# Altium schematic sheet Connector.SchDoc: Connectors Sheet
size A3; Author: Kubilay Közleme; Organization: My Company; Address1: Address Line 1; Address2: Address Line 2; Address3: Address Line 3; Address4: Address Line 4; SheetNumber: 5; SheetTotal: 5; ProjectTitle: Drone Fligth Controller
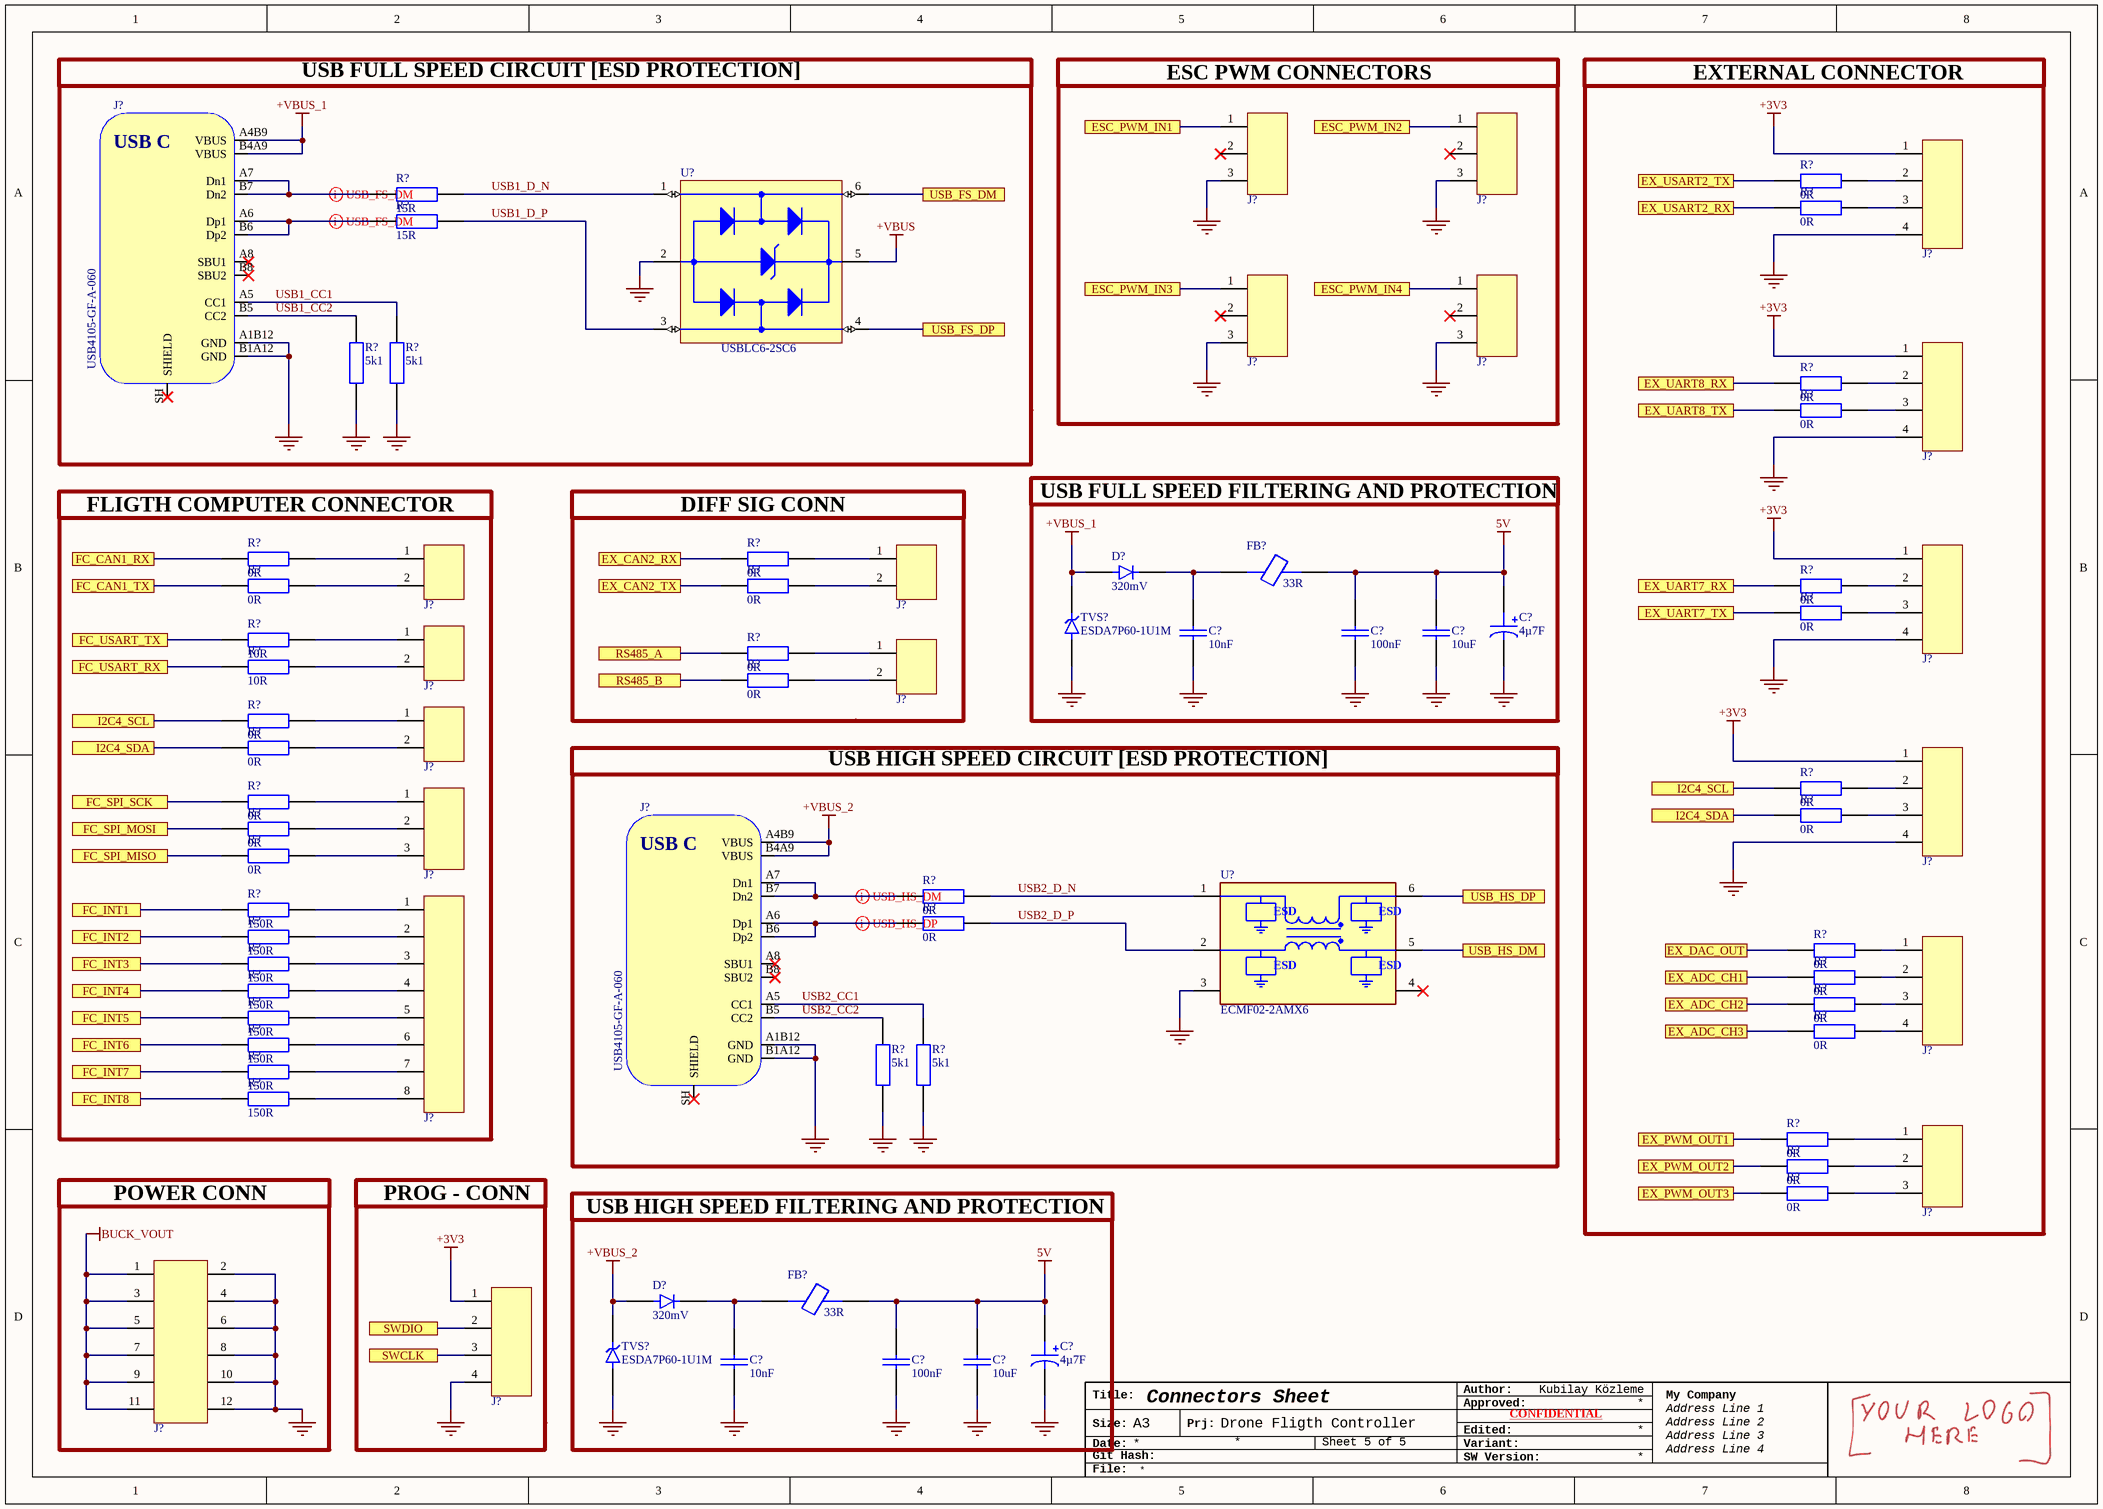
[diagram p0: Connector.SchDoc]

## Parts
(Parts that share a designator on the sheet are numbered #1, #2 ... from top to bottom, then left to right.)
C?#1  Capacitance Value: 4µ7F  [EDH475M025S9BAA]  (hidden comment: EDH475M025S9BAA)
C?#2  value 10nF  [CAP_0603]  (hidden comment: 0603B103K160CT)
C?#3  Capacitance: 100nF  [CAP_0603]  (hidden comment: C0603C104K1RACTU)
C?#4  value 10uF  [CAP_0603]  (hidden comment: ZRB18AR61C106ME01L)
C?#5  Capacitance Value: 4µ7F  [EDH475M025S9BAA]  (hidden comment: EDH475M025S9BAA)
C?#6  value 10nF  [CAP_0603]  (hidden comment: 0603B103K160CT)
C?#7  Capacitance: 100nF  [CAP_0603]  (hidden comment: C0603C104K1RACTU)
C?#8  value 10uF  [CAP_0603]  (hidden comment: ZRB18AR61C106ME01L)
D?#1  Forward Voltage-Max (VF): 320mV  [SOD-323]  (hidden comment: BAT60JFILM)
D?#2  Forward Voltage-Max (VF): 320mV  [SOD-323]  (hidden comment: BAT60JFILM)
FB?#1  Impedance: 33R  [BLM18PG330SN1D]  (hidden comment: BLM18PG330SN1D)
FB?#2  Impedance: 33R  [BLM18PG330SN1D]  (hidden comment: BLM18PG330SN1D)
J?#1  USB4105-GF-A-060  [USB4105-GF-A-060]
J?#2  0022272031  [0022272031]  (value not drawn)
J?#3  0022272031  [0022272031]  (value not drawn)
J?#4  S4B-PH-SM4-TB  [S4B-PH-SM4-TB]  (value not drawn)
J?#5  0022272031  [0022272031]  (value not drawn)
J?#6  0022272031  [0022272031]  (value not drawn)
J?#7  S4B-PH-SM4-TB  [S4B-PH-SM4-TB]  (value not drawn)
J?#8  S2B-PH-SM4-TB  [S2B-PH-SM4-TB]  (value not drawn)
J?#9  691502710002  [691502710002]  (value not drawn)
J?#10  S4B-PH-SM4-TB  [S4B-PH-SM4-TB]  (value not drawn)
J?#11  S2B-PH-SM4-TB  [S2B-PH-SM4-TB]  (value not drawn)
J?#12  691502710002  [691502710002]  (value not drawn)
J?#13  S2B-PH-SM4-TB  [S2B-PH-SM4-TB]  (value not drawn)
J?#14  S4B-PH-SM4-TB  [S4B-PH-SM4-TB]  (value not drawn)
J?#15  S3B-PH-SM4-TB  [S3B-PH-SM4-TB]  (value not drawn)
J?#16  USB4105-GF-A-060  [USB4105-GF-A-060]
J?#17  S8B-PH-SM4-TB  [S8B-PH-SM4-TB]  (value not drawn)
J?#18  S4B-PH-SM4-TB  [S4B-PH-SM4-TB]  (value not drawn)
J?#19  S3B-PH-SM4-TB  [S3B-PH-SM4-TB]  (value not drawn)
J?#20  G800W590018EU  [G800W590018EU]  (value not drawn)
J?#21  BCS-104-F-S-TE  [BCS-104-F-S-TE]  (value not drawn)
R?#1  Resistance: 0R  [RES_0603]  (hidden comment: RC0603JR-070RL)
R?#2  value 15R  [RES_0603]  (hidden comment: RC0603JR-0715RL)
R?#3  Resistance: 0R  [RES_0603]  (hidden comment: RC0603JR-070RL)
R?#4  value 15R  [RES_0603]  (hidden comment: RC0603JR-0715RL)
R?#5  Resistance: 0R  [RES_0603]  (hidden comment: RC0603JR-070RL)
R?#6  Resistance: 5k1  [RES_0603]  (hidden comment: RC0603FR-075K1L)
R?#7  Resistance: 5k1  [RES_0603]  (hidden comment: RC0603FR-075K1L)
R?#8  Resistance: 0R  [RES_0603]  (hidden comment: RC0603JR-070RL)
R?#9  Resistance: 0R  [RES_0603]  (hidden comment: RC0603JR-070RL)
R?#10  Resistance: 0R  [RES_0603]  (hidden comment: RC0603JR-070RL)
R?#11  Resistance: 0R  [RES_0603]  (hidden comment: RC0603JR-070RL)
R?#12  Resistance: 0R  [RES_0603]  (hidden comment: RC0603JR-070RL)
R?#13  Resistance: 0R  [RES_0603]  (hidden comment: RC0603JR-070RL)
R?#14  Resistance: 0R  [RES_0603]  (hidden comment: RC0603JR-070RL)
R?#15  Resistance: 10R  (hidden comment: ERJ-6ENF10R0V)
R?#16  Resistance: 0R  [RES_0603]  (hidden comment: RC0603JR-070RL)
R?#17  Resistance: 10R  (hidden comment: ERJ-6ENF10R0V)
R?#18  Resistance: 0R  [RES_0603]  (hidden comment: RC0603JR-070RL)
R?#19  Resistance: 0R  [RES_0603]  (hidden comment: RC0603JR-070RL)
R?#20  Resistance: 0R  [RES_0603]  (hidden comment: RC0603JR-070RL)
R?#21  Resistance: 0R  [RES_0603]  (hidden comment: RC0603JR-070RL)
R?#22  Resistance: 0R  [RES_0603]  (hidden comment: RC0603JR-070RL)
R?#23  Resistance: 0R  [RES_0603]  (hidden comment: RC0603JR-070RL)
R?#24  Resistance: 0R  [RES_0603]  (hidden comment: RC0603JR-070RL)
R?#25  Resistance: 0R  [RES_0603]  (hidden comment: RC0603JR-070RL)
R?#26  Resistance: 0R  [RES_0603]  (hidden comment: RC0603JR-070RL)
R?#27  Resistance: 150R  [RES_0603]  (hidden comment: RC0603FR-07150RL)
R?#28  Resistance: 0R  [RES_0603]  (hidden comment: RC0603JR-070RL)
R?#29  Resistance: 150R  [RES_0603]  (hidden comment: RC0603FR-07150RL)
R?#30  Resistance: 0R  [RES_0603]  (hidden comment: RC0603JR-070RL)
R?#31  Resistance: 150R  [RES_0603]  (hidden comment: RC0603FR-07150RL)
R?#32  Resistance: 0R  [RES_0603]  (hidden comment: RC0603JR-070RL)
R?#33  Resistance: 150R  [RES_0603]  (hidden comment: RC0603FR-07150RL)
R?#34  Resistance: 0R  [RES_0603]  (hidden comment: RC0603JR-070RL)
R?#35  Resistance: 150R  [RES_0603]  (hidden comment: RC0603FR-07150RL)
R?#36  Resistance: 0R  [RES_0603]  (hidden comment: RC0603JR-070RL)
R?#37  Resistance: 150R  [RES_0603]  (hidden comment: RC0603FR-07150RL)
R?#38  Resistance: 150R  [RES_0603]  (hidden comment: RC0603FR-07150RL)
R?#39  Resistance: 150R  [RES_0603]  (hidden comment: RC0603FR-07150RL)
R?#40  Resistance: 5k1  [RES_0603]  (hidden comment: RC0603FR-075K1L)
R?#41  Resistance: 5k1  [RES_0603]  (hidden comment: RC0603FR-075K1L)
R?#42  Resistance: 0R  [RES_0603]  (hidden comment: RC0603JR-070RL)
R?#43  Resistance: 0R  [RES_0603]  (hidden comment: RC0603JR-070RL)
R?#44  Resistance: 0R  [RES_0603]  (hidden comment: RC0603JR-070RL)
TVS?#1  ESDA7P60-1U1M  [ESDA7P60-1U1M]
TVS?#2  ESDA7P60-1U1M  [ESDA7P60-1U1M]
U?#1  USBLC6-2SC6  [SOT23-6L]
U?#2  ECMF02-2AMX6  [ECMF02-2AMX6]

## Blocks framed on the sheet
USB FULL SPEED CIRCUIT [ESD PROTECTION]: J?#1 R?#2 R?#4 R?#6 R?#7 U?#1
ESC PWM CONNECTORS: J?#2 J?#3 J?#5 J?#6
EXTERNAL CONNECTOR: J?#4 J?#7 J?#10 J?#14 J?#18 J?#19 R?#1 R?#3 R?#5 R?#8 R?#13 R?#14 R?#21 R?#23 R?#30 R?#32 R?#34 R?#36 R?#42-R?#44
FLIGTH COMPUTER CONNECTOR: J?#8 J?#11 J?#13 J?#15 J?#17 R?#9 R?#11 R?#15 R?#17 R?#19 R?#20 R?#22 R?#24 R?#25 R?#27 R?#29 R?#31 R?#33 R?#35 R?#37-R?#39
DIFF SIG CONN: J?#9 J?#12 R?#10 R?#12 R?#16 R?#18
USB FULL SPEED FILTERING AND PROTECTION: C?#1-C?#4 D?#1 FB?#1 TVS?#1
USB HIGH SPEED CIRCUIT [ESD PROTECTION]: J?#16 R?#26 R?#28 R?#40 R?#41 U?#2
POWER CONN: J?#20
PROG - CONN: J?#21
USB HIGH SPEED FILTERING AND PROTECTION: C?#5-C?#8 D?#2 FB?#2 TVS?#2

## Ports
ESC_PWM_IN1 (see Microcontroller[3C]), ESC_PWM_IN2 (see Microcontroller[3C]), ESC_PWM_IN3 (see Microcontroller[3C]), ESC_PWM_IN4 (see Microcontroller[3C]), EX_ADC_CH1 (see Microcontroller[3C]), EX_ADC_CH2 (see Microcontroller[3C]), EX_ADC_CH3 (see Microcontroller[3C]), EX_CAN2_RX (see Microcontroller[3B]), EX_CAN2_TX (see Microcontroller[3C]), EX_DAC_OUT (see Microcontroller[3C]), EX_PWM_OUT1 (see Microcontroller[1C]), EX_PWM_OUT2 (see Microcontroller[1C]), EX_PWM_OUT3 (see Microcontroller[1C]), EX_UART7_RX (see Microcontroller[3C]), EX_UART7_TX (see Microcontroller[3C]), EX_UART8_RX (see Microcontroller[3C]), EX_UART8_TX (see Microcontroller[3C]), EX_USART2_RX (see Microcontroller[3C]), EX_USART2_TX (see Microcontroller[3C]), FC_CAN1_RX (see Microcontroller[3C]), FC_CAN1_TX (see Microcontroller[3C]), FC_INT1 (see Microcontroller[1C]), FC_INT2 (see Microcontroller[1C]), FC_INT3 (see Microcontroller[1C]), FC_INT4 (see Microcontroller[1C]), FC_INT5 (see Microcontroller[1C]), FC_INT6 (see Microcontroller[1C]), FC_INT7 (see Microcontroller[1C]), FC_INT8 (see Microcontroller[1C]), FC_SPI_MISO (see Microcontroller[3B]), FC_SPI_MOSI (see Microcontroller[3B]), FC_SPI_SCK (see Microcontroller[3B]), FC_USART_RX (see Microcontroller[3B]), FC_USART_TX (see Microcontroller[3B]), I2C4_SCL (see Connector[1B], Microcontroller[1B], Microcontroller[8B]), I2C4_SCL (see Connector[7C], Microcontroller[1B], Microcontroller[8B]), I2C4_SDA (see Connector[1B], Microcontroller[1B], Microcontroller[8B]), I2C4_SDA (see Connector[7C], Microcontroller[1B], Microcontroller[8B]), RS485_A, RS485_B, SWCLK (see Microcontroller[3B]), SWDIO (see Microcontroller[3A]), USB_FS_DM (see Microcontroller[1C]), USB_FS_DP (see Microcontroller[1C]), USB_HS_DM (see Microcontroller[1C]), USB_HS_DP (see Microcontroller[1C])

## Nets
5V: C?#1.1 C?#3.2 C?#4.2 C?#5.1 C?#7.2 C?#8.2 FB?#1.2 FB?#2.2
+3V3: J?#4.1 J?#7.1 J?#10.1 J?#14.1 J?#21.1
+VBUS: U?#1.5(VBUS)
+VBUS_1: D?#1.A J?#1.A4B9(VBUS) J?#1.B4A9(VBUS) TVS?#1.C
+VBUS_2: D?#2.A J?#16.A4B9(VBUS) J?#16.B4A9(VBUS) TVS?#2.C
BUCK_VOUT: J?#20.1 J?#20.3 J?#20.5 J?#20.7 J?#20.9 J?#20.11
GND: C?#1.2 C?#2.1 C?#3.1 C?#4.1 C?#5.2 C?#6.1 C?#7.1 C?#8.1 J?#1.A1B12(GND) J?#1.B1A12(GND) J?#2.3 J?#3.3 J?#4.4 J?#5.3 J?#6.3 J?#7.4 J?#10.4 J?#14.4 J?#16.A1B12(GND) J?#16.B1A12(GND) J?#20.2 J?#20.4 J?#20.6 J?#20.8 J?#20.10 J?#20.12 J?#21.4 R?#6.1 R?#7.1 R?#40.1 R?#41.1 TVS?#1.A TVS?#2.A U?#1.2(GND) U?#2.3(GND)
ESC_PWM_IN1: J?#2.1 ; port ESC_PWM_IN1
ESC_PWM_IN2: J?#3.1 ; port ESC_PWM_IN2
ESC_PWM_IN3: J?#5.1 ; port ESC_PWM_IN3
ESC_PWM_IN4: J?#6.1 ; port ESC_PWM_IN4
EX_ADC_CH1: R?#32.1 ; port EX_ADC_CH1
EX_ADC_CH2: R?#34.1 ; port EX_ADC_CH2
EX_ADC_CH3: R?#36.1 ; port EX_ADC_CH3
EX_CAN2_RX: R?#10.1 ; port EX_CAN2_RX
EX_CAN2_TX: R?#12.1 ; port EX_CAN2_TX
EX_DAC_OUT: R?#30.1 ; port EX_DAC_OUT
EX_PWM_OUT1: R?#42.1 ; port EX_PWM_OUT1
EX_PWM_OUT2: R?#43.1 ; port EX_PWM_OUT2
EX_PWM_OUT3: R?#44.1 ; port EX_PWM_OUT3
EX_UART7_RX: R?#13.1 ; port EX_UART7_RX
EX_UART7_TX: R?#14.1 ; port EX_UART7_TX
EX_UART8_RX: R?#5.1 ; port EX_UART8_RX
EX_UART8_TX: R?#8.1 ; port EX_UART8_TX
EX_USART2_RX: R?#3.1 ; port EX_USART2_RX
EX_USART2_TX: R?#1.1 ; port EX_USART2_TX
FC_CAN1_RX: R?#9.1 ; port FC_CAN1_RX
FC_CAN1_TX: R?#11.1 ; port FC_CAN1_TX
FC_INT1: R?#27.1 ; port FC_INT1
FC_INT2: R?#29.1 ; port FC_INT2
FC_INT3: R?#31.1 ; port FC_INT3
FC_INT4: R?#33.1 ; port FC_INT4
FC_INT5: R?#35.1 ; port FC_INT5
FC_INT6: R?#37.1 ; port FC_INT6
FC_INT7: R?#38.1 ; port FC_INT7
FC_INT8: R?#39.1 ; port FC_INT8
FC_SPI_MISO: R?#25.1 ; port FC_SPI_MISO
FC_SPI_MOSI: R?#24.1 ; port FC_SPI_MOSI
FC_SPI_SCK: R?#22.1 ; port FC_SPI_SCK
FC_USART_RX: R?#17.1 ; port FC_USART_RX
FC_USART_TX: R?#15.1 ; port FC_USART_TX
I2C4_SCL: R?#19.1 R?#21.1 ; port I2C4_SCL
I2C4_SDA: R?#20.1 R?#23.1 ; port I2C4_SDA
RS485_A: R?#16.1 ; port RS485_A
RS485_B: R?#18.1 ; port RS485_B
SWCLK: J?#21.3 ; port SWCLK
SWDIO: J?#21.2 ; port SWDIO
USB1_CC1: J?#1.A5(CC1) R?#7.2
USB1_CC2: J?#1.B5(CC2) R?#6.2
USB1_D_N: R?#2.2 U?#1.1(I/O1_IN)
USB1_D_P: R?#4.2 U?#1.3(I/O2_IN)
USB2_CC1: J?#16.A5(CC1) R?#41.2
USB2_CC2: J?#16.B5(CC2) R?#40.2
USB2_D_N: R?#26.2 U?#2.1(D+_IN)
USB2_D_P: R?#28.2 U?#2.2(D-_IN)
USB_FS_DM: U?#1.6(I/O1_OUT) ; port USB_FS_DM
USB_FS_DP: U?#1.4(I/O2_OUT) ; port USB_FS_DP
USB_HS_DM: U?#2.5(D-_OUT) ; port USB_HS_DM
USB_HS_DP: U?#2.6(D+_OUT) ; port USB_HS_DP
NetC?#2_2: C?#2.2 D?#1.C FB?#1.1
NetC?#6_2: C?#6.2 D?#2.C FB?#2.1
NetJ?#1_A6: J?#1.A6(Dp1) J?#1.B6(Dp2) R?#4.1
NetJ?#1_A7: J?#1.A7(Dn1) J?#1.B7(Dn2) R?#2.1
NetJ?#4_2: J?#4.2 R?#1.2
NetJ?#4_3: J?#4.3 R?#3.2
NetJ?#7_2: J?#7.2 R?#5.2
NetJ?#7_3: J?#7.3 R?#8.2
NetJ?#8_1: J?#8.1 R?#9.2
NetJ?#8_2: J?#8.2 R?#11.2
NetJ?#9_1: J?#9.1 R?#10.2
NetJ?#9_2: J?#9.2 R?#12.2
NetJ?#10_2: J?#10.2 R?#13.2
NetJ?#10_3: J?#10.3 R?#14.2
NetJ?#11_1: J?#11.1 R?#15.2
NetJ?#11_2: J?#11.2 R?#17.2
NetJ?#12_1: J?#12.1 R?#16.2
NetJ?#12_2: J?#12.2 R?#18.2
NetJ?#13_1: J?#13.1 R?#19.2
NetJ?#13_2: J?#13.2 R?#20.2
NetJ?#14_2: J?#14.2 R?#21.2
NetJ?#14_3: J?#14.3 R?#23.2
NetJ?#15_1: J?#15.1 R?#22.2
NetJ?#15_2: J?#15.2 R?#24.2
NetJ?#15_3: J?#15.3 R?#25.2
NetJ?#16_A6: J?#16.A6(Dp1) J?#16.B6(Dp2) R?#28.1
NetJ?#16_A7: J?#16.A7(Dn1) J?#16.B7(Dn2) R?#26.1
NetJ?#17_1: J?#17.1 R?#27.2
NetJ?#17_2: J?#17.2 R?#29.2
NetJ?#17_3: J?#17.3 R?#31.2
NetJ?#17_4: J?#17.4 R?#33.2
NetJ?#17_5: J?#17.5 R?#35.2
NetJ?#17_6: J?#17.6 R?#37.2
NetJ?#17_7: J?#17.7 R?#38.2
NetJ?#17_8: J?#17.8 R?#39.2
NetJ?#18_1: J?#18.1 R?#30.2
NetJ?#18_2: J?#18.2 R?#32.2
NetJ?#18_3: J?#18.3 R?#34.2
NetJ?#18_4: J?#18.4 R?#36.2
NetJ?#19_1: J?#19.1 R?#42.2
NetJ?#19_2: J?#19.2 R?#43.2
NetJ?#19_3: J?#19.3 R?#44.2

Not connected (* = marked no-connect by the designer): J?#1 A8(SBU1)* B8(SBU2)* SH(SHIELD)*; J?#2 2*; J?#3 2*; J?#5 2*; J?#6 2*; J?#16 A8(SBU1)* B8(SBU2)* SH(SHIELD)*; U?#2 4(NC)*

## Layout directives
differential pair; differential pair class USB_FS: NetJ?#1_A6, NetJ?#1_A7
differential pair; differential pair class USB_HS: NetJ?#16_A6, NetJ?#16_A7

## Notes on the sheet
- Pin current rated 3A
  Max out current 6A
- Title:
- Author:
- Approved:
- Size:
- Date:
- Git Hash:
- A3
- Prj:
- SW Version:
- Variant:
- Edited:
- CONFIDENTIAL
- File:
- (in symbol ECMF02-2AMX6) ESD
- (in symbol USB4105-GF-A-060) USB C

## Library data of the parts
C?#1 C?#5 = EDH475M025S9BAA: EDH ALUMINUM ELECTROLYTIC CAPACITOR Radial Can - SMD aluminum electrolytic capacitor 0.157Dia 4.00mm ±20% 4.7muF 25V; Manufacturer: KEMET; Designed By: Kubilay Közleme; Supplier 1: Digikey; Manufacturer Part Number: EDH475M025S9BAA; Category: Aluminum Electrolytic Capacitors; Stock 1: 40000; Pricing 1: 1=0.31, 10=0.183, 50=0.131, 100=0.1149, 500=0.08754, 1000=0.07901 (USD); ComponentLink1URL: https://api.kemet.com/component-edge/download/datasheet/EDH475M025S9BAA.pdf?src-supplier=Digikey; ComponentLink1Description: https://api.kemet.com/component-edge/download/datasheet/EDH475M025S9BAA.pdf?src-supplier=Digikey; Supplier Part Number 1: 399-EDH475M025S9BAACT-ND
C?#2 C?#6 = CAP CER 10nF 0603: 0603 16V X7R .01uF 10% multilayer ceramic capacitor; Manufacturer: Walsin Technologies; Designed By: Kubilay Közleme; Supplier 1: Digikey; Manufacturer Part Number: 0603B103K160CT; RoHS: Yes; Category: Ceramic Capacitors; Stock 1: 65786; Pricing 1: 1=0.1, 10=0.031, 50=0.018, 100=0.0139, 500=0.0105, 1000=0.00825 (USD); Lead Free: 5697LeadFree; ComponentLink1URL: http://www.farnell.com/datasheets/1958513.pdf?src-supplier=Farnell; ComponentLink1Description: http://www.farnell.com/datasheets/1958513.pdf?src-supplier=Farnell; ComponentLink2URL: https://datasheet.octopart.com/0603B103K160CT-Walsin-Technologies-datasheet-136037192.pdf?src-supplier=Future+Electronics; ComponentLink2Description: https://datasheet.octopart.com/0603B103K160CT-Walsin-Technologies-datasheet-136037192.pdf?src-supplier=Future+Electronics; ComponentLink3URL: http://www.passivecomponent.com/wp-content/uploads/2018/10/MLCC.pdf?src-supplier=Digikey; ComponentLink3Description: http://www.passivecomponent.com/wp-content/uploads/2018/10/MLCC.pdf?src-supplier=Digikey; ComponentLink4URL: https://datasheet.octopart.com/0603B103K160CT-Walsin-Technologies-datasheet-85392065.pdf?src-supplier=Element14; ComponentLink4Description: https://datasheet.octopart.com/0603B103K160CT-Walsin-Technologies-datasheet-85392065.pdf?src-supplier=Element14; ComponentLink5URL: https://datasheet.octopart.com/0603B103K160CT-Walsin-Technologies-datasheet-62066062.pdf?src-supplier=TME; ComponentLink5Description: https://datasheet.octopart.com/0603B103K160CT-Walsin-Technologies-datasheet-62066062.pdf?src-supplier=TME; Supplier Part Number 1: 1292-1384-1-ND
C?#3 C?#7 = CAP CER 100nF 0603: Cap Cer 0603 0.1UF 100VDC X7R; Manufacturer: KEMET; Dielectric: 1511DielectricType; Voltage Rating (DC): 100V; Designed By: Kubilay Közleme; Supplier 1: Digikey; Manufacturer Part Number: C0603C104K1RACTU; RoHS: No; Category: Ceramic Capacitors; Stock 1: 10169; Pricing 1: 1=0.28, 10=0.185, 50=0.1296, 100=0.1047, 500=0.07782, 1000=0.06808 (USD); Case/Package: 345Case; Supplier Part Number 1: 399-C0603C104K1RACTUCT-ND
C?#4 C?#8 = CAP CER 10uF 0603: Ceramic Capacitor, Multilayer, Ceramic, 16V, 20% +Tol, 20% -Tol, X5R, 15% TC, 10uF, Surface Mount, 0603; Manufacturer: Murata; Designed By: Kubilay Közleme; Supplier 1: Digikey; RoHS: Yes; Category: Ceramic Capacitors; Stock 1: 123060; Pricing 1: 1=0.48, 10=0.284, 50=0.2068, 100=0.1828, 500=0.14188, 1000=0.1291 (USD); Number of Pins: 2; Dielectric Material: Ceramic; Capacitor Type: Ceramic; Reach SVHC Compliant: Yes; RoHS Compliant: Yes; ComponentLink1URL: https://datasheet.ciiva.com:443/pdfs/VipMasterIC/IC/MURE/MURE-S-A0004380799/MURE-S-A0004414209-1.pdf?src-supplier=IHS+Markit; ComponentLink1Description: https://datasheet.ciiva.com:443/pdfs/VipMasterIC/IC/MURE/MURE-S-A0004380799/MURE-S-A0004414209-1.pdf?src-supplier=IHS+Markit; ComponentLink2URL: http://www.farnell.com/datasheets/2163235.pdf?src-supplier=Farnell; ComponentLink2Description: http://www.farnell.com/datasheets/2163235.pdf?src-supplier=Farnell; ComponentLink3URL: http://search.murata.co.jp/Ceramy/image/img/A01X/G101/ENG/ZRB18AR61C106ME01-01.pdf?src-supplier=Digikey; ComponentLink3Description: http://search.murata.co.jp/Ceramy/image/img/A01X/G101/ENG/ZRB18AR61C106ME01-01.pdf?src-supplier=Digikey; ComponentLink4URL: http://www.farnell.com/datasheets/2163235.pdf?src-supplier=Newark; ComponentLink4Description: http://www.farnell.com/datasheets/2163235.pdf?src-supplier=Newark; ComponentLink5URL: http://www.farnell.com/datasheets/2163235.pdf?src-supplier=Element14; ComponentLink5Description: http://www.farnell.com/datasheets/2163235.pdf?src-supplier=Element14; ComponentLink6URL: https://datasheet.octopart.com/ZRB18AR61C106ME01L-Murata-datasheet-62317488.pdf?src-supplier=Element14; ComponentLink6Description: https://datasheet.octopart.com/ZRB18AR61C106ME01L-Murata-datasheet-62317488.pdf?src-supplier=Element14; ComponentLink7URL: https://datasheet.octopart.com/ZRB18AR61C106ME01L-Murata-datasheet-67356777.pdf?src-supplier=Newark; ComponentLink7Description: https://datasheet.octopart.com/ZRB18AR61C106ME01L-Murata-datasheet-67356777.pdf?src-supplier=Newark; ComponentLink8URL: https://datasheet.octopart.com/ZRB18AR61C106ME01L-Murata-datasheet-86813782.pdf?src-supplier=Future+Electronics; ComponentLink8Description: https://datasheet.octopart.com/ZRB18AR61C106ME01L-Murata-datasheet-86813782.pdf?src-supplier=Future+Electronics; ComponentLink9URL: https://datasheet.octopart.com/ZRB18AR61C106ME01L-Murata-datasheet-166166242.pdf?src-supplier=TME; ComponentLink9Description: https://datasheet.octopart.com/ZRB18AR61C106ME01L-Murata-datasheet-166166242.pdf?src-supplier=TME; Supplier Part Number 1: 490-10990-6-ND; Manufacturer Part Number: ZRB18AR61C106ME01L
D?#1 D?#2 = BAT60JFILM: Rectifier Diode, Schottky, 1 Phase, 1 Element, 3A, 10V V(RRM), Silicon; Manufacturer: STMicroelectronics; Package Body Material: Plastic; Application(s): GENERAL PURPOSE; Non-rep Pk Forward Current-Max: 5A; Number of Elements: 1; Max Power Dissipation: 310mW; Time @ Peak Reflow Temperature-Max (s): 30s; Qualification Status: Not Qualified; Designed By: Kubilay Közleme; Supplier 1: Digikey; Manufacturer Part Number: BAT60JFILM; RoHS: Yes; Category: Rectifier Diodes; Stock 1: 166671; Pricing 1: 1=0.22, 10=0.15, 100=0.1007, 500=0.07718, 1000=0.06926 (USD); Number of Pins: 2; Diode Element Material: SILICON; Package Shape: Rectangular; Terminal Finish: Tin; Max Operating Temperature: 150°C; JESD-609 Code: e3; Diode Type: RECTIFIER; JESD-30 Code: R-PDSO-G2; Moisture Sensitivity Level: 1; Number of Phases: 1; Max Output Current: 3A; Package Style: SMALL OUTLINEMeter; Peak Reflow Temperature (Cel): 260°C; Rep Pk Reverse Voltage-Max: 10V; Surface Mount: Yes; Technology: SCHOTTKY; Terminal Form: Gull Wing; Terminal Position: DUAL; Reach SVHC Compliant: Yes; RoHS Compliant: Yes; ComponentLink1URL: https://datasheet.ciiva.com:443/pdfs/VipMasterIC/IC/SGST/SGSTS19081/SGSTS19081-1.pdf?src-supplier=IHS+Markit; ComponentLink1Description: https://datasheet.ciiva.com:443/pdfs/VipMasterIC/IC/SGST/SGSTS19081/SGSTS19081-1.pdf?src-supplier=IHS+Markit; ComponentLink2URL: https://datasheet.ciiva.com/1200/1689728-1200741.pdf?src-supplier=Farnell; ComponentLink2Description: https://datasheet.ciiva.com/1200/1689728-1200741.pdf?src-supplier=Farnell; ComponentLink3URL: https://datasheet.ciiva.com/4714/cd00001944-96586-4714681.pdf?src-supplier=Mouser; ComponentLink3Description: https://datasheet.ciiva.com/4714/cd00001944-96586-4714681.pdf?src-supplier=Mouser; ComponentLink4URL: https://datasheet.ciiva.com/23916/cd00001944-23916545.pdf?src-supplier=Newark; ComponentLink4Description: https://datasheet.ciiva.com/23916/cd00001944-23916545.pdf?src-supplier=Newark; ComponentLink5URL: https://datasheet.ciiva.com/17078/bat60jfilm-17078717.pdf?src-supplier=Allied+Electronics; ComponentLink5Description: https://datasheet.ciiva.com/17078/bat60jfilm-17078717.pdf?src-supplier=Allied+Electronics; ComponentLink6URL: https://datasheet.ciiva.com/915/cd00001944-915607.pdf?src-supplier=Digikey; ComponentLink6Description: https://datasheet.ciiva.com/915/cd00001944-915607.pdf?src-supplier=Digikey; ComponentLink7URL: https://datasheet.ciiva.com/915/cd00001944-915608.pdf?src-supplier=Digikey; ComponentLink7Description: https://datasheet.ciiva.com/915/cd00001944-915608.pdf?src-supplier=Digikey; ComponentLink8URL: https://datasheet.ciiva.com/915/cd00001944-915609.pdf?src-supplier=Digikey; ComponentLink8Description: https://datasheet.ciiva.com/915/cd00001944-915609.pdf?src-supplier=Digikey; ComponentLink9URL: https://datasheet.ciiva.com/15144/getdatasheetpartid-91415-15144683.pdf?src-supplier=Verical; ComponentLink9Description: https://datasheet.ciiva.com/15144/getdatasheetpartid-91415-15144683.pdf?src-supplier=Verical; Supplier Part Number 1: 497-3707-1-ND
FB?#1 FB?#2 = BLM18PG330SN1D: Ferrite Beads Multi-Layer 33 Ohm 25% 100MHz 3A 25m Ohm DCR 0603 Paper; Manufacturer: Murata; Manufacturer Series: BLM18P; Material: Steel,Ferrite; Resistance: 25mR; Number of Lines: 1; Shielding: Unshielded; Designed By: Kubilay Közleme; Supplier 1: Digikey; Manufacturer Part Number: BLM18PG330SN1D; RoHS: Yes; Category: Ferrite Beads and Chips; Stock 1: 80000; Pricing 1: 4000=0.0223, 8000=0.01943, 12000=0.01785, 20000=0.01725 (USD); Case/Package: 0603; Number of Pins: 2; Core Material: Ferrite; Case Code (Metric): 1608; Case Code (Imperial): 0603; Terminal Finish: Tin; Min Operating Temperature: -55°C; Max Operating Temperature: 125°C; Package Quantity: 1; Tolerance: 25%; Packaging: Tape and Reel; Current Rating: 3A; ESR (Equivalent Series Resistance): 33R; Max Current Rating: 3A; DC Resistance (DCR): 25mR; Max DC Current: 3A; Termination: SMD/SMT; Test Frequency: 100MHz; DC Current: 3A; Number of Circuits: 1; Series: BLM18P; DC Resistance-Max: 25mR; Number of Functions: 1; RMS Current (Irms): 3A; Series Resistance: 25mR; Length: 1.6mm; Width: 0.8mm; Height: 0.8mm; Depth: 0.8mm; Radiation Hardening: No; Reach SVHC Compliant: No; Lead Free: Lead Free; RoHS Compliant: Yes; ComponentLink1URL: https://datasheet.ciiva.com/8021/5148-8021488.pdf?src-supplier=Element14; ComponentLink1Description: https://datasheet.ciiva.com/8021/5148-8021488.pdf?src-supplier=Element14; ComponentLink2URL: https://datasheet.ciiva.com/19458/1845056-19458409.pdf?src-supplier=Jameco; ComponentLink2Description: https://datasheet.ciiva.com/19458/1845056-19458409.pdf?src-supplier=Jameco; ComponentLink3URL: https://datasheet.ciiva.com/1012/l0110s0100blm18p-1012160.pdf?src-supplier=Digikey; ComponentLink3Description: https://datasheet.ciiva.com/1012/l0110s0100blm18p-1012160.pdf?src-supplier=Digikey; ComponentLink4URL: https://datasheet.ciiva.com/11799/0900766b81275ca5-11799524.pdf?src-supplier=Rs; ComponentLink4Description: https://datasheet.ciiva.com/11799/0900766b81275ca5-11799524.pdf?src-supplier=Rs; ComponentLink5URL: https://datasheet.ciiva.com/1012/l0110s0100blm18p-1012159.pdf?src-supplier=Digikey; ComponentLink5Description: https://datasheet.ciiva.com/1012/l0110s0100blm18p-1012159.pdf?src-supplier=Digikey; ComponentLink6URL: https://datasheet.ciiva.com/1012/l0110s0100blm18p-1012158.pdf?src-supplier=Digikey; ComponentLink6Description: https://datasheet.ciiva.com/1012/l0110s0100blm18p-1012158.pdf?src-supplier=Digikey; ComponentLink7URL: https://datasheet.ciiva.com/16420/l0110s0100blm18p-16420745.pdf?src-supplier=Future+Electronics; ComponentLink7Description: https://datasheet.ciiva.com/16420/l0110s0100blm18p-16420745.pdf?src-supplier=Future+Electronics; Supplier Part Number 1: 490-5220-2-ND
J?#1 J?#16 = USB4105-GF-A-060: USB Connector, 24 Contact(s), Female, Right Angle, Solder Terminal, Locking, Receptacle; Manufacturer: Global Connector Technology; Designed By: Kubilay Közleme; Supplier 1: Digikey; Manufacturer Part Number: USB4105-GF-A-060; RoHS: Yes; Category: Connectors; Stock 1: 2521; Pricing 1: 1=1.04, 10=0.789, 25=0.7096, 50=0.6552, 100=0.6057, 250=0.54704 (USD); ComponentLink1URL: https://datasheet.octopart.com/USB4105-GF-A-060-GCT-datasheet-166929323.pdf?src-supplier=TME; ComponentLink1Description: https://datasheet.octopart.com/USB4105-GF-A-060-GCT-datasheet-166929323.pdf?src-supplier=TME; Supplier Part Number 1: 2073-USB4105-GF-A-060DKR-ND
J?#2 J?#3 J?#5 J?#6 = 0022272031: Board Connector, 3 Contact(s), 1 Row(s), Male, Straight, 0.1 inch Pitch, Solder Terminal, Locking, White Insulator, Receptacle; Manufacturer: Molex; Option: General Purpose; Filter Feature: No; Mating Information: MULTIPLE MATING PARTS AVAILABLE; Number of Rows Loaded: 1; Number of Contacts: 3; Contact Pattern: RECTANGULAR; Contact Resistance: 10mR; Contact Style: SQ PIN-SKT; Durability: 25Cycles; Insulation Resistance: 1GR; Polarization Key: POLARIZED HOUSING; Rated Current (Signal): 4A; Body Breadth: 0.23inch; Body Depth: 0.46inch; Body Length: 0.3inch; Plating Thickness: 100uin; Reference Standard: UL; Reliability: COMMERCIAL; Designed By: Kubilay Közleme; Supplier 1: Digikey; Manufacturer Part Number: 22-27-2031; RoHS: Yes; Category: Headers and Wire Housings; Stock 1: 123474; Pricing 1: 1=0.46, 10=0.34, 100=0.2589, 500=0.21876, 2000=0.19237, 6000=0.1757, 10000=0.16902 (USD); Mount: Board; Contact Finish - Mating: TIN; Contact Finish - Termination: Tin (Sn); Contact Material: Brass; Insulation Color: White; Insulation Material: Nylon; Min Operating Temperature: 0°C; Max Operating Temperature: 75°C; Connector Type: BOARD CONNECTOR; JESD-609 Code: e3; Contact Gender: Male; Mixed Contacts: No; Mounting Style: STRAIGHT; Termination: Solder; Body/Shell Style: RECEPTACLE; Number Of Connectors: 1; Number Of PCB Rows: 1; PCB Contact Pattern: RECTANGULAR; Terminal Pitch: 2.54mm; Mating Contact Pitch: 0.1inch; Mounting Option 1: LOCKING; Terminal Length: 0.14inch; Flammability Rating: UL94 V-0; Reach SVHC Compliant: Yes; RoHS Compliant: Yes; DIN Conformance: No; IEC Conformance: No; MIL Conformance: No; ComponentLink1URL: https://datasheet.ciiva.com:443/pdfs/VipMasterIC/IC/MOLE/MOLE-E-A0003552261/MOLE-S-A0003534498-1.pdf?src-supplier=IHS+Markit; ComponentLink1Description: https://datasheet.ciiva.com:443/pdfs/VipMasterIC/IC/MOLE/MOLE-E-A0003552261/MOLE-S-A0003534498-1.pdf?src-supplier=IHS+Markit; Supplier Part Number 1: WM4112-ND
J?#4 J?#7 J?#10 J?#14 J?#18 = S4B-PH-SM4-TB: Header S4B-PH-SM4-TB, 2.00mm, 4-contacts, side entry, SMT, /1000/reel; Manufacturer: JST; Designed By: Kubilay Közleme; Supplier 1: Digikey; Manufacturer Part Number: S4B-PH-SM4-TB; RoHS: No; Category: Connectors; Stock 1: 6528; Pricing 1: 1=0.78, 10=0.682, 100=0.5621, 500=0.48874 (USD); ComponentLink1URL: https://datasheet.ciiva.com/26894/getdatasheetpartid-560757-26894923.pdf?src-supplier=Verical; ComponentLink1Description: https://datasheet.ciiva.com/26894/getdatasheetpartid-560757-26894923.pdf?src-supplier=Verical; Supplier Part Number 1: 455-S4B-PH-SM4-TBCT-ND
J?#8 J?#11 J?#13 = S2B-PH-SM4-TB: Header S2B-PH-SM4-TB, 2.00mm, 2-contacts, side entry, SMT, /1000/reel; Manufacturer: JST; Designed By: Kubilay Közleme; Supplier 1: Digikey; Manufacturer Part Number: S2B-PH-SM4-TB; RoHS: Yes; Stock 1: 61817; Pricing 1: 1=0.58, 10=0.503, 100=0.4143, 500=0.36024 (USD); Supplier Part Number 1: 455-S2B-PH-SM4-TBCT-ND
J?#9 J?#12 = 691502710002: Terminal Block, Wtb, 2Way, 22-14Awg Rohs Compliant: Yes |Wurth Elektronik 691502710002; Manufacturer: Wurth Electronics; Designed By: Kubilay Közleme; Supplier 1: Digikey; Manufacturer Part Number: 691502710002; RoHS: No; Category: Terminal Blocks; Stock 1: 52389; Pricing 1: 1=0.69, 10=0.64, 50=0.608, 100=0.568, 450=0.486 (USD); Supplier Part Number 1: 732-691502710002-ND
J?#15 J?#19 = S3B-PH-SM4-TB: Header S3B-PH-SM4-TB, 2.00mm, 3-contacts, side entry, SMT, /1000/reel; Manufacturer: JST; Designed By: Kubilay Közleme; Supplier 1: Digikey; Manufacturer Part Number: S3B-PH-SM4-TB; RoHS: No; Stock 1: 3472; Pricing 1: 1=0.8, 10=0.607, 100=0.465, 500=0.38888 (USD); Supplier Part Number 1: 455-S3B-PH-SM4-TBCT-ND
J?#17 = S8B-PH-SM4-TB: Header S8B-PH-SM4-TB, 2.00mm, 8-contacts, side entry, SMT, /1000/reel; Manufacturer: JST; Designed By: Kubilay Közleme; Supplier 1: Digikey; Manufacturer Part Number: S8B-PH-SM4-TB; RoHS: No; Stock 1: 15475; Pricing 1: 1=0.96, 10=0.812, 100=0.7288, 500=0.59626 (USD); Supplier Part Number 1: 455-S8B-PH-SM4-TBCT-ND
J?#20 = G800W590018EU: Board to Board Connector Straight Header Dual Row 12 Position 2.54mm Pitch Through Hole Bag; Manufacturer: Amphenol; Designed By: Kubilay Közleme; Supplier 1: Digikey; Manufacturer Part Number: G800W590018EU; RoHS: No; Category: Connectors; Stock 1: 1889; Pricing 1: 1=0.26, 10=0.223, 100=0.1715, 500=0.1451, 1000=0.11872, 5000=0.10552, 10000=0.09563 (USD); Supplier Part Number 1: 664-G800W590018EU-ND
J?#21 = BCS-104-F-S-TE: Board Connector, 4 Contact(s), 1 Row(s), Female, Straight, Solder Terminal, Socket; Manufacturer: Samtec; Manufacturer Series: BCS-1; Option: General Purpose; Filter Feature: No; Mating Information: MULTIPLE MATING PARTS AVAILABLE; Number of Rows Loaded: 1; Number of Contacts: 4; Designed By: Kubilay Közleme; Supplier 1: Digikey; Manufacturer Part Number: BCS-104-F-S-TE; RoHS: Yes; Category: Connectors; Stock 1: 3894; Pricing 1: 1=1.14, 50=0.951, 100=0.8128, 500=0.7223, 1000=0.6375 (USD); Mount: Board; Contact Material: Bronze; Contact Finish - Mating: GOLD FLASH (3) OVER NICKEL (50); Contact Finish - Termination: Tin (Sn) - with Nickel (Ni) barrier; Connector Type: BOARD CONNECTOR; JESD-609 Code: e3; Body/Shell Style: SOCKET; Contact Gender: Female; Mixed Contacts: No; Mounting Style: STRAIGHT; Termination: Solder; Terminal Pitch: 2.54mm; Flammability Rating: UL94 V-0; DIN Conformance: No; IEC Conformance: No; MIL Conformance: No; Reach SVHC Compliant: Yes; RoHS Compliant: Yes; ComponentLink1URL: https://datasheet.ciiva.com:443/pdfs/VipMasterIC/IC/SAMI/SAMI-S-A0002541218/SAMI-S-A0002541218-1.pdf?src-supplier=IHS+Markit; ComponentLink1Description: https://datasheet.ciiva.com:443/pdfs/VipMasterIC/IC/SAMI/SAMI-S-A0002541218/SAMI-S-A0002541218-1.pdf?src-supplier=IHS+Markit; ComponentLink2URL: https://datasheet.ciiva.com/10180/bcs-10180171.pdf?src-supplier=Avnet; ComponentLink2Description: https://datasheet.ciiva.com/10180/bcs-10180171.pdf?src-supplier=Avnet; Supplier Part Number 1: BCS-104-F-S-TE-ND
R?#1 R?#3 R?#5 R?#8-R?#14 R?#16 R?#18-R?#26 R?#28 R?#30 R?#32 R?#34 R?#36 R?#42-R?#44 = RES 0 OHM 0603: GENERAL PURPOSE CHIP RESISTOR Metal Glaze/thick Film, 0.1W, 0ohm, Surface Mount, 0603; Manufacturer: Yageo; Tolerance: 1%; Power Rating: 100mW; Voltage Rating (DC): 50V; Temperature Coefficient: 200ppm/°C; Resistance Tolerance: 5%; Designed By: Kubilay Közleme; Supplier 1: Digikey; Manufacturer Part Number: RC0603JR-070RL; RoHS: Yes; Category: Chip SMD Resistors; Stock 1: 2772986; Pricing 1: 5000=0.00203, 10000=0.00177, 25000=0.00155, 50000=0.00142, 125000=0.00139 (USD); Case/Package: 0603; Number of Pins: 2; Contact Plating: Tin,Matte; Case Code (Imperial): 0603; Case Code (Metric): 1608; Size Code: 0603; Min Operating Temperature: -55°C; Max Operating Temperature: 155°C; Resistor Type: Thick Film; Packaging: Tape and Reel; Termination: SMD/SMT; Series: RC; Technology: THICK FILM; Package Quantity: 5000; Voltage Rating: 50V; Features: Moisture Resistant; Max Power Dissipation: 100mW; Number of Terminations: 2; Construction: Rectangular; Length: 1.6mm; Width: 0.8mm; Height: 0.45mm; Depth: 0.8mm; Reach SVHC Compliant: Unknown; Lead Free: 5697LeadFree; RoHS Compliant: Yes; Military Standard: Not; Supplier Part Number 1: 311-0.0GRTR-ND
R?#2 R?#4 = RES 15 OHM 0603: SMD Chip Resistor, 15 Ohm, ± 5%, 100 mW, 0603 [1608 Metric], Thick Film, General Purpose; Manufacturer: Yageo; Voltage Rating (AC): 50V; Designed By: Kubilay Közleme; Supplier 1: Digikey; Manufacturer Part Number: RC0603JR-0715RL; RoHS: Yes; Category: Chip SMD Resistors; Stock 1: 102284; Pricing 1: 1=0.1, 10=0.015, 50=0.0092, 100=0.0076, 500=0.00512, 1000=0.00437 (USD); ComponentLink1URL: https://datasheet.ciiva.com/2453/pyu-r-int-thick-7-2453085.pdf?src-supplier=Digikey; ComponentLink1Description: https://datasheet.ciiva.com/2453/pyu-r-int-thick-7-2453085.pdf?src-supplier=Digikey; ComponentLink2URL: https://datasheet.ciiva.com/2453/pyu-r-int-thick-7-2453086.pdf?src-supplier=Digikey; ComponentLink2Description: https://datasheet.ciiva.com/2453/pyu-r-int-thick-7-2453086.pdf?src-supplier=Digikey; ComponentLink3URL: https://datasheet.ciiva.com/2453/pyu-r-int-thick-7-2453087.pdf?src-supplier=Digikey; ComponentLink3Description: https://datasheet.ciiva.com/2453/pyu-r-int-thick-7-2453087.pdf?src-supplier=Digikey; ComponentLink4URL: https://datasheet.ciiva.com/7746/443971-7746445.pdf?src-supplier=Element14; ComponentLink4Description: https://datasheet.ciiva.com/7746/443971-7746445.pdf?src-supplier=Element14; ComponentLink5URL: https://datasheet.ciiva.com/7746/443971-7746446.pdf?src-supplier=Element14; ComponentLink5Description: https://datasheet.ciiva.com/7746/443971-7746446.pdf?src-supplier=Element14; Supplier Part Number 1: 311-15GRCT-ND
R?#6 R?#7 R?#40 R?#41 = RES 5K1 OHM 0603: SMD Chip Resistor, 5.1 kOhm, ï¿½ 1%, 100 mW, 0603 [1608 Metric], Thick Film, General Purpose; Manufacturer: Yageo; Voltage Rating (DC): 50V; Power Rating: 100mW; Temperature Coefficient: 100ppm/°C; Designed By: Kubilay Közleme; Supplier 1: Digikey; Manufacturer Part Number: RC0603FR-075K1L; RoHS: Yes; Category: Chip SMD Resistors; Stock 1: 2074223; Pricing 1: 1=0.1, 10=0.019, 50=0.0112, 100=0.0093, 500=0.00622, 1000=0.00532 (USD); Case/Package: 0603; Number of Pins: 2NUMBER; Case Code (Imperial): 0603; Case Code (Metric): 1608; Size Code: 0603; Min Operating Temperature: -55°C; Max Operating Temperature: 155°C; Tolerance: 1%; Voltage Rating: 50V; Packaging: Tape and Reel; Package Quantity: 1; Termination: SMD/SMT; Resistor Type: Thick Film; Number of Terminations: 2; Max Power Dissipation: 100mW; Features: Moisture Resistant; Series: RC; Resistance Tolerance: 1%; Construction: Rectangular; Length: 0.063inch; Width: 0.031inch; Height: 0.022inch; Depth: 0.8mm; Lead Free: 5697LeadFree; Reach SVHC Compliant: No; RoHS Compliant: Yes; Military Standard: Not; ComponentLink1URL: https://datasheet.ciiva.com/46395/443971-46395016.pdf?src-supplier=Element14; ComponentLink1Description: https://datasheet.ciiva.com/46395/443971-46395016.pdf?src-supplier=Element14; ComponentLink2URL: https://datasheet.ciiva.com/2454/pyu-r-int-thick-7-2454046.pdf?src-supplier=Digikey; ComponentLink2Description: https://datasheet.ciiva.com/2454/pyu-r-int-thick-7-2454046.pdf?src-supplier=Digikey; ComponentLink3URL: https://datasheet.ciiva.com/2454/pyu-r-int-thick-7-2454047.pdf?src-supplier=Digikey; ComponentLink3Description: https://datasheet.ciiva.com/2454/pyu-r-int-thick-7-2454047.pdf?src-supplier=Digikey; ComponentLink4URL: https://datasheet.ciiva.com/2454/pyu-r-int-thick-7-2454045.pdf?src-supplier=Digikey; ComponentLink4Description: https://datasheet.ciiva.com/2454/pyu-r-int-thick-7-2454045.pdf?src-supplier=Digikey; ComponentLink5URL: https://datasheet.ciiva.com/15189/getdatasheetpartid-326732-15189786.pdf?src-supplier=Verical; ComponentLink5Description: https://datasheet.ciiva.com/15189/getdatasheetpartid-326732-15189786.pdf?src-supplier=Verical; Supplier Part Number 1: 311-5.10KHRDKR-ND
R?#15 R?#17 = RES 10 OHM 0805: Fixed Resistor, Metal Glaze/thick Film, 0.125W, 10ohm, 150V, 1% +/-Tol, 100ppm/Cel, Surface Mount, 0805; Manufacturer: Panasonic; Rated Power Dissipation (P): 125mW; Rated Temperature: 70°C; Temperature Coefficient: 100ppm/°C; Package Height: 0.6mm; Package Length: 2mm; Package Width: 1.25mm; Reference Standard: AEC-Q200; Designed By: Kubilay Közleme; Supplier 1: Digikey; Manufacturer Part Number: ERJ-6ENF10R0V; RoHS: Yes; Category: Chip SMD Resistors; Stock 1: 1359168; Pricing 1: 1=0.11, 10=0.053, 50=0.0344, 100=0.0292, 500=0.02058, 1000=0.01792 (USD); Mount: Surface Mount; Number of Pins: 2; Package Shape: Rectangular; Size Code: 0805; Terminal Finish: Nickel; Min Operating Temperature: -55°C; Max Operating Temperature: 155°C; Tolerance: 1%; JESD-609 Code: e3; Resistor Type: FIXED RESISTOR; Construction: Rectangular; Package Style: SMTMeter; Packaging: Tape and Reel; Technology: METAL GLAZE/THICK FILM; Termination: Wraparound; Working Voltage: 150V; Reach SVHC Compliant: Yes; RoHS Compliant: Yes; ComponentLink1URL: https://datasheet.ciiva.com:443/pdfs/VipMasterIC/IC/PANA/PANA-S-A0009889626/PANA-S-A0009889626-1.pdf?src-supplier=IHS+Markit; ComponentLink1Description: https://datasheet.ciiva.com:443/pdfs/VipMasterIC/IC/PANA/PANA-S-A0009889626/PANA-S-A0009889626-1.pdf?src-supplier=IHS+Markit; ComponentLink2URL: https://datasheet.ciiva.com/34303/1989009-34303620.pdf?src-supplier=Jameco; ComponentLink2Description: https://datasheet.ciiva.com/34303/1989009-34303620.pdf?src-supplier=Jameco; ComponentLink3URL: https://datasheet.ciiva.com/46372/1678782-46372965.pdf?src-supplier=Element14; ComponentLink3Description: https://datasheet.ciiva.com/46372/1678782-46372965.pdf?src-supplier=Element14; ComponentLink4URL: https://datasheet.ciiva.com/46372/1678782-46372966.pdf?src-supplier=Element14; ComponentLink4Description: https://datasheet.ciiva.com/46372/1678782-46372966.pdf?src-supplier=Element14; ComponentLink5URL: https://datasheet.ciiva.com/24026/aoa0000ce2-24026310.pdf?src-supplier=Mouser; ComponentLink5Description: https://datasheet.ciiva.com/24026/aoa0000ce2-24026310.pdf?src-supplier=Mouser; ComponentLink6URL: https://datasheet.ciiva.com/16787/70260748-16787450.pdf?src-supplier=Allied+Electronics; ComponentLink6Description: https://datasheet.ciiva.com/16787/70260748-16787450.pdf?src-supplier=Allied+Electronics; ComponentLink7URL: https://datasheet.ciiva.com/9117/aoa0000ce2-9117399.pdf?src-supplier=Avnet; ComponentLink7Description: https://datasheet.ciiva.com/9117/aoa0000ce2-9117399.pdf?src-supplier=Avnet; ComponentLink8URL: https://datasheet.ciiva.com/16449/aoa0000ce2-16449373.pdf?src-supplier=Future+Electronics; ComponentLink8Description: https://datasheet.ciiva.com/16449/aoa0000ce2-16449373.pdf?src-supplier=Future+Electronics; Supplier Part Number 1: P10.0CDKR-ND
R?#27 R?#29 R?#31 R?#33 R?#35 R?#37-R?#39 = RES 150 OHM 0603: Fixed Resistor, Metal Glaze/thick Film, 0.1W, 150ohm, 75V, 1% +/-Tol, 100ppm/Cel, Surface Mount, 0603; Manufacturer: Yageo; Additional Feature: LASER TRIMMABLE; Rated Power Dissipation (P): 100mW; Rated Temperature: 70°C; Temperature Coefficient: 100ppm/°C; Package Height: 0.45mm; Package Length: 1.6mm; Package Width: 0.8mm; Designed By: Kubilay Közleme; Supplier 1: Digikey; Manufacturer Part Number: RC0603FR-07150RL; RoHS: Yes; Category: Chip SMD Resistors; Stock 1: 470210; Pricing 1: 1=0.1, 10=0.019, 50=0.0112, 100=0.0093, 500=0.00622, 1000=0.00532 (USD); Mount: Surface Mount; Number of Pins: 2; Package Shape: Rectangular; Size Code: 0603; Terminal Finish: Nickel; Min Operating Temperature: -55°C; Max Operating Temperature: 155°C; Tolerance: 1%; JESD-609 Code: e3; Resistor Type: FIXED RESISTOR; Construction: Chip; Package Style: SMTMeter; Packaging: Tape and Reel; Technology: METAL GLAZE/THICK FILM; Termination: Wraparound; Working Voltage: 75V; Reach SVHC Compliant: Yes; RoHS Compliant: Yes; ComponentLink1URL: https://datasheet.ciiva.com:443/pdfs/VipMasterIC/IC/YAGO/YAGO-S-A0008145938/YAGO-S-A0008145938-1.pdf?src-supplier=IHS+Markit; ComponentLink1Description: https://datasheet.ciiva.com:443/pdfs/VipMasterIC/IC/YAGO/YAGO-S-A0008145938/YAGO-S-A0008145938-1.pdf?src-supplier=IHS+Markit; ComponentLink2URL: https://datasheet.ciiva.com/46440/1868787-46440893.pdf?src-supplier=Element14; ComponentLink2Description: https://datasheet.ciiva.com/46440/1868787-46440893.pdf?src-supplier=Element14; ComponentLink3URL: https://datasheet.ciiva.com/12555/rc0603-272842-12555301.pdf?src-supplier=Mouser; ComponentLink3Description: https://datasheet.ciiva.com/12555/rc0603-272842-12555301.pdf?src-supplier=Mouser; Supplier Part Number 1: 311-150HRCT-ND
TVS?#1 TVS?#2 = ESDA7P60-1U1M: Trans Voltage Suppressor Diode, 700W, 5V V(RWM), Unidirectional, 1 Element, Silicon; Manufacturer: STMicroelectronics; Designed By: Kubilay Közleme; Supplier 1: Digikey; Manufacturer Part Number: ESDA7P60-1U1M; RoHS: Yes; Category: TVS Diodes; Stock 1: 72605; Pricing 1: 1=0.37, 10=0.245, 100=0.1654, 500=0.1281, 1000=0.11568, 2000=0.10507 (USD); Diode Type: TRANS VOLTAGE SUPPRESSOR; Reach SVHC Compliant: Yes; RoHS Compliant: Yes; ComponentLink1URL: https://datasheet.ciiva.com:443/pdfs/VipMasterIC/IC/SGST/SGST-S-A0001313824/SGST-S-A0001313824-1.pdf?src-supplier=IHS+Markit; ComponentLink1Description: https://datasheet.ciiva.com:443/pdfs/VipMasterIC/IC/SGST/SGST-S-A0001313824/SGST-S-A0001313824-1.pdf?src-supplier=IHS+Markit; ComponentLink2URL: http://www.farnell.com/datasheets/2041290.pdf?src-supplier=Farnell; ComponentLink2Description: http://www.farnell.com/datasheets/2041290.pdf?src-supplier=Farnell; ComponentLink3URL: http://www.st.com/content/ccc/resource/technical/document/datasheet/44/e9/26/44/42/ee/4f/e5/DM00139972.pdf/files/DM00139972.pdf/jcr:content/translations/en.DM00139972.pdf?src-supplier=Digikey; ComponentLink3Description: http://www.st.com/content/ccc/resource/technical/document/datasheet/44/e9/26/44/42/ee/4f/e5/DM00139972.pdf/files/DM00139972.pdf/jcr:content/translations/en.DM00139972.pdf?src-supplier=Digikey; ComponentLink4URL: http://www.farnell.com/datasheets/2041290.pdf?src-supplier=Element14; ComponentLink4Description: http://www.farnell.com/datasheets/2041290.pdf?src-supplier=Element14; Supplier Part Number 1: 497-16253-1-ND
U?#1 = USBLC6-2SC6: ESD Suppressor Diode Arrays Uni-Dir 15kV@Air Gap/8kV@Contact Disc 6-Pin SOT-23 T/R; Manufacturer: STMicroelectronics; Direction: Unidirectional,Bidirectional; Capacitance: 3.5pF; Operating Supply Voltage: 1.1V; Number of Channels: 2; Breakdown Voltage: 6V; Clamping Voltage: 17V; Reverse Standoff Voltage: 5.25V; Power Line Protection: Yes; Test Current: 1mA; Max Reverse Leakage Current: 150nA; Peak Pulse Current: 5A; Data Rate: 480Mbps; Number of Elements: 1; Working Voltage: 5V; Designed By: Kubilay Közleme; Supplier 1: Digikey; Manufacturer Part Number: USBLC6-2SC6; RoHS: Yes; Category: TVS Diodes; Stock 1: 81407; Pricing 1: 1=0.35, 10=0.273, 100=0.1636, 500=0.1515, 1000=0.10302 (USD); Mount: Surface Mount; Case/Package: SOT-23; Number of Pins: 6; Min Operating Temperature: -40°C; Max Operating Temperature: 125°C; Packaging: Tape and Reel; Package Quantity: 3000; Termination: SMD/SMT; Number of Bidirectional Channels: 2; Min Breakdown Voltage: 6V; ESD Protection: Yes; Leakage Current: 150nA; Series: USB; Reverse Breakdown Voltage: 6V; Polarity: Unidirectional,Bidirectional; Max Breakdown Voltage: 6V; Clamping Voltage-Max: 17V; Max Repetitive Reverse Voltage (Vrrm): 5.25V; Length: 3.05mm; Width: 1.75mm; Height: 1.3mm; Depth: 1.75mm; Radiation Hardening: No; Lead Free: Lead Free; Reach SVHC Compliant: No; RoHS Compliant: Yes; ComponentLink1URL: https://datasheet.ciiva.com/1268/1690354-1268384.pdf?src-supplier=Element14; ComponentLink1Description: https://datasheet.ciiva.com/1268/1690354-1268384.pdf?src-supplier=Element14; ComponentLink2URL: https://datasheet.ciiva.com/4508/cd00050750-113117-4508433.pdf?src-supplier=Mouser; ComponentLink2Description: https://datasheet.ciiva.com/4508/cd00050750-113117-4508433.pdf?src-supplier=Mouser; ComponentLink3URL: https://datasheet.ciiva.com/15143/getdatasheetpartid-148465-15143789.pdf?src-supplier=Verical; ComponentLink3Description: https://datasheet.ciiva.com/15143/getdatasheetpartid-148465-15143789.pdf?src-supplier=Verical; ComponentLink4URL: https://datasheet.ciiva.com/16200/cd00050750-16200026.pdf?src-supplier=Future+Electronics; ComponentLink4Description: https://datasheet.ciiva.com/16200/cd00050750-16200026.pdf?src-supplier=Future+Electronics; ComponentLink5URL: https://datasheet.ciiva.com/41444/001184109-da-01-en-ic-esd-protecti-usblc6-2sc6-sot-23-6-stm-41444156.pdf?src-supplier=Conrad; ComponentLink5Description: https://datasheet.ciiva.com/41444/001184109-da-01-en-ic-esd-protecti-usblc6-2sc6-sot-23-6-stm-41444156.pdf?src-supplier=Conrad; Supplier Part Number 1: 497-5235-1-ND
U?#2 = ECMF02-2AMX6: Data Line Filter, 2 Function(s), 6 Pin(s), Plastic; Manufacturer: STMicroelectronics; DC Resistance-Max: 2.5R; Number of Functions: 2; Approvals: UL,IECV; Designed By: Kubilay Közleme; Supplier 1: Digikey; Manufacturer Part Number: ECMF02-2AMX6; RoHS: Yes; Category: Common Mode Chokes; Stock 1: 139873; Pricing 1: 1=0.52, 10=0.448, 25=0.4104, 50=0.3732, 100=0.3321, 250=0.31348, 500=0.2687, 1000=0.23884 (USD); Mount: Surface Mount; Number of Pins: 6; Package Material: Plastic; Min Operating Temperature: -40°C; Max Operating Temperature: 85°C; Filter Type: DATA LINE FILTER; Packaging: Tape and Reel; Length: 1.75mm; Width: 1.55mm; Height: 0.55mm; Reach SVHC Compliant: Yes; RoHS Compliant: Yes; ComponentLink1URL: https://datasheet.ciiva.com:443/pdfs/VipMasterIC/IC/SGST/SGST-S-A0002909654/SGST-S-A0002909654-1.pdf?src-supplier=IHS+Markit; ComponentLink1Description: https://datasheet.ciiva.com:443/pdfs/VipMasterIC/IC/SGST/SGST-S-A0002909654/SGST-S-A0002909654-1.pdf?src-supplier=IHS+Markit; ComponentLink2URL: https://datasheet.ciiva.com/4941/cd00282307-118081-4941944.pdf?src-supplier=Mouser; ComponentLink2Description: https://datasheet.ciiva.com/4941/cd00282307-118081-4941944.pdf?src-supplier=Mouser; ComponentLink3URL: https://datasheet.ciiva.com/16200/cd00282307-16200867.pdf?src-supplier=Future+Electronics; ComponentLink3Description: https://datasheet.ciiva.com/16200/cd00282307-16200867.pdf?src-supplier=Future+Electronics; ComponentLink4URL: https://datasheet.ciiva.com/15120/getdatasheetpartid-259862-15120030.pdf?src-supplier=Verical; ComponentLink4Description: https://datasheet.ciiva.com/15120/getdatasheetpartid-259862-15120030.pdf?src-supplier=Verical; ComponentLink5URL: https://datasheet.ciiva.com/6214/cd00282307-6214629.pdf?src-supplier=Digikey; ComponentLink5Description: https://datasheet.ciiva.com/6214/cd00282307-6214629.pdf?src-supplier=Digikey; ComponentLink6URL: https://datasheet.ciiva.com/6214/cd00282307-6214638.pdf?src-supplier=Digikey; ComponentLink6Description: https://datasheet.ciiva.com/6214/cd00282307-6214638.pdf?src-supplier=Digikey; ComponentLink7URL: https://datasheet.ciiva.com/6214/cd00282307-6214634.pdf?src-supplier=Digikey; ComponentLink7Description: https://datasheet.ciiva.com/6214/cd00282307-6214634.pdf?src-supplier=Digikey; Supplier Part Number 1: 497-10773-1-ND